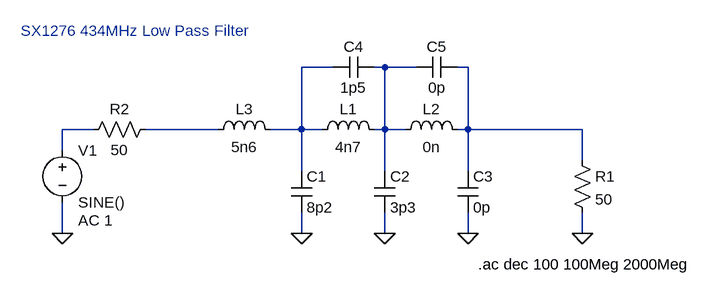
[diagram p0: schematic SX1276868M.asc]
SX1276868M.asc, the LTspice schematic file:
Version 4
SHEET 1 880 680
WIRE 48 112 0 112
WIRE 128 112 112 112
WIRE 176 112 128 112
WIRE 256 112 240 112
WIRE -320 208 -368 208
WIRE -128 208 -240 208
WIRE 0 208 0 112
WIRE 0 208 -48 208
WIRE 32 208 0 208
WIRE 128 208 128 112
WIRE 128 208 112 208
WIRE 160 208 128 208
WIRE 256 208 256 112
WIRE 256 208 240 208
WIRE 432 208 256 208
WIRE -368 240 -368 208
WIRE 432 256 432 208
WIRE 0 272 0 208
WIRE 128 272 128 208
WIRE 256 272 256 208
WIRE -368 368 -368 320
WIRE 0 368 0 336
WIRE 128 368 128 336
WIRE 256 368 256 336
WIRE 432 368 432 336
FLAG 0 368 0
FLAG 128 368 0
FLAG 256 368 0
FLAG 432 368 0
FLAG -368 368 0
SYMBOL cap -16 272 R0
SYMATTR InstName C1
SYMATTR Value 8p2
SYMBOL cap 112 272 R0
SYMATTR InstName C2
SYMATTR Value 3p3
SYMBOL cap 240 272 R0
SYMATTR InstName C3
SYMATTR Value 0p
SYMBOL ind 16 224 R270
WINDOW 0 32 56 VTop 2
WINDOW 3 5 56 VBottom 2
SYMATTR InstName L1
SYMATTR Value 4n7
SYMBOL ind 144 224 R270
WINDOW 0 32 56 VTop 2
WINDOW 3 5 56 VBottom 2
SYMATTR InstName L2
SYMATTR Value 0n
SYMBOL cap 240 96 R90
WINDOW 0 0 32 VBottom 2
WINDOW 3 32 32 VTop 2
SYMATTR InstName C5
SYMATTR Value 0p
SYMBOL res 416 240 R0
SYMATTR InstName R1
SYMATTR Value 50
SYMBOL res -224 192 R90
WINDOW 0 0 56 VBottom 2
WINDOW 3 32 56 VTop 2
SYMATTR InstName R2
SYMATTR Value 50
SYMBOL voltage -368 224 R0
WINDOW 123 24 124 Left 2
WINDOW 39 0 0 Left 0
SYMATTR Value2 AC 1
SYMATTR InstName V1
SYMATTR Value SINE()
SYMBOL cap 112 96 R90
WINDOW 0 0 32 VBottom 2
WINDOW 3 32 32 VTop 2
SYMATTR InstName C4
SYMATTR Value 1p5
SYMBOL ind -144 224 R270
WINDOW 0 32 56 VTop 2
WINDOW 3 5 56 VBottom 2
SYMATTR InstName L3
SYMATTR Value 5n6
TEXT 272 416 Left 2 !.ac dec 100 100Meg 2000Meg
TEXT -432 56 Left 2 ;SX1276 434MHz Low Pass Filter

The netlist it stands for:
* SX1276868M.asc
C1 N001 0 8p2
C2 N002 0 3p3
C3 N003 0 0p
L1 N001 N002 4n7
L2 N002 N003 0n
C5 N003 N002 0p
R1 N003 0 50
R2 N005 N004 50
V1 N004 0 SINE() AC 1
C4 N002 N001 1p5
L3 N005 N001 5n6
.ac dec 100 100Meg 2000Meg
* SX1276 434MHz Low Pass Filter
.backanno
.end